# Altium schematic sheet ESP32.SchDoc
size A4
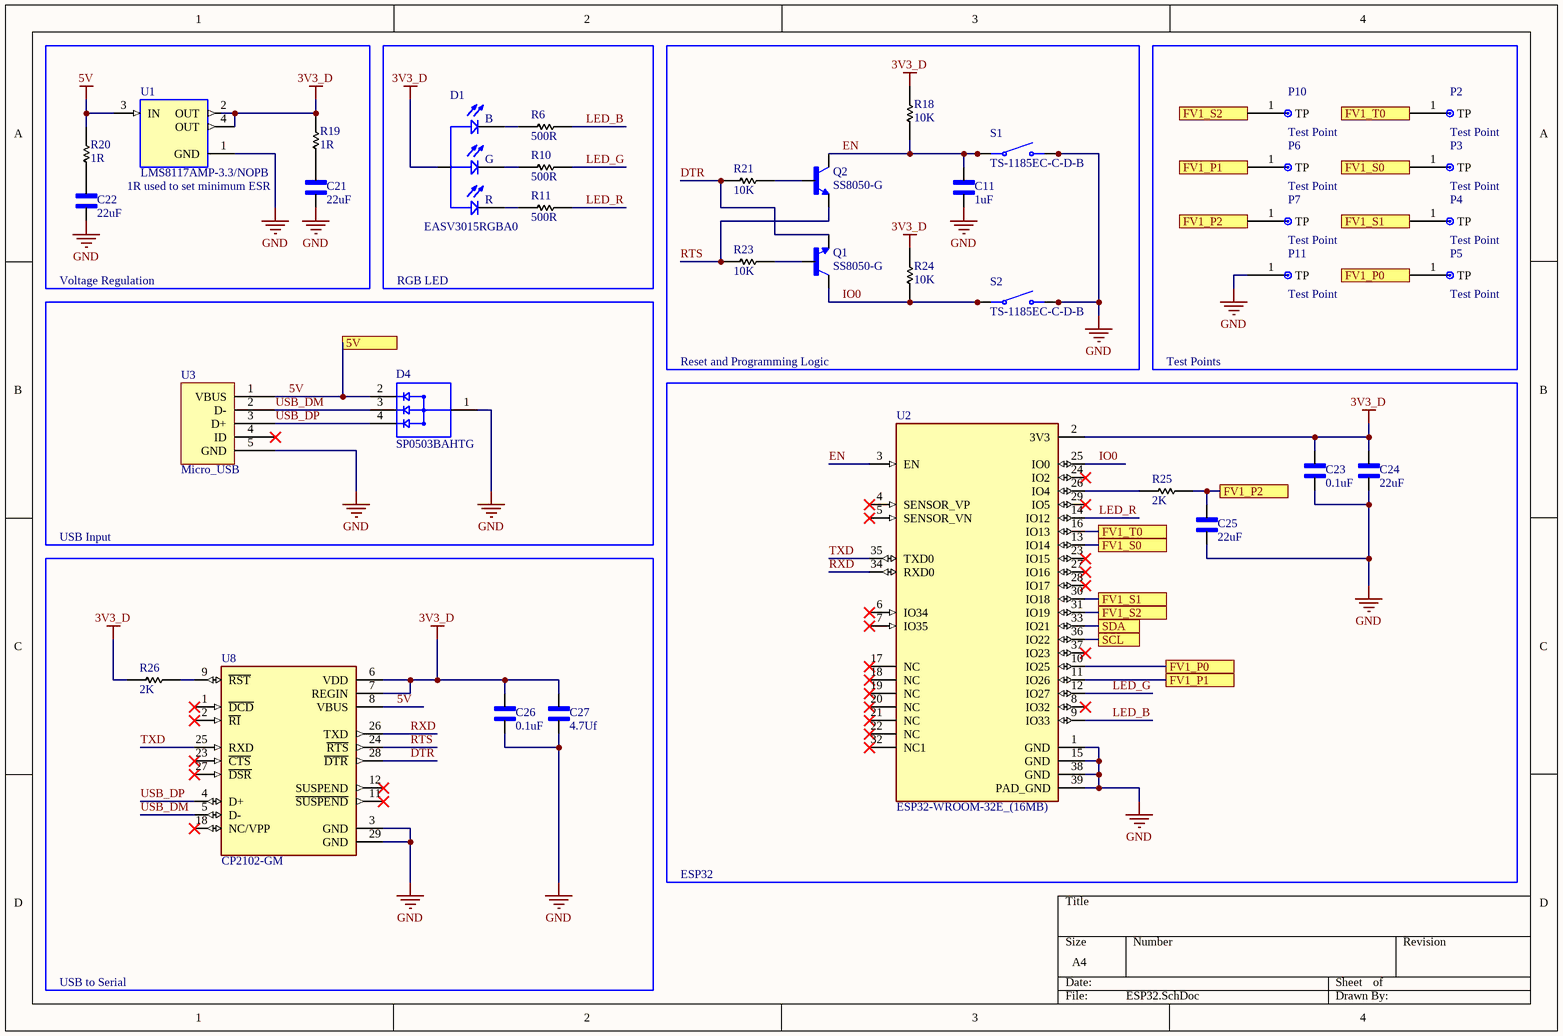
[diagram p0: ESP32.SchDoc]

## Parts
C11  1uF  [CHIP_0603]
C21  22uF  [CHIP_0603]
C22  22uF  [CHIP_0603]
C23  0.1uF  [CHIP_0603]
C24  22uF  [CHIP_0603]
C25  22uF  [CHIP_0603]
C26  0.1uF  [CHIP_0603]
C27  4.7Uf  [CHIP_0603]
D1  EASV3015RGBA0  [LED_EASV3015RGBA0]
D4  SP0503BAHTG  [SP0503BAHTG]
P2  Test Point  [1 Solder Pad]
P3  Test Point  [1 Solder Pad]
P4  Test Point  [1 Solder Pad]
P5  Test Point  [1 Solder Pad]
P6  Test Point  [1 Solder Pad]
P7  Test Point  [1 Solder Pad]
P10  Test Point  [1 Solder Pad]
P11  Test Point  [1 Solder Pad]
Q1  SS8050-G  [SS8050-G]
Q2  SS8050-G  [SS8050-G]
R6  500R  [CHIP_R_0603]
R10  500R  [CHIP_R_0603]
R11  500R  [CHIP_R_0603]
R18  10K  [CHIP_R_0603]
R19  1R  [CHIP_R_0603]
R20  1R  [CHIP_R_0603]
R21  10K  [CHIP_R_0603]
R23  10K  [CHIP_R_0603]
R24  10K  [CHIP_R_0603]
R25  2K  [CHIP_R_0603]
R26  2K  [CHIP_R_0603]
S1  TS-1185EC-C-D-B  [TS-1185EC-C-D-B]
S2  TS-1185EC-C-D-B  [TS-1185EC-C-D-B]
U1  LMS8117AMP-3.3/NOPB  [SOT230P700X180-4N]
U2  ESP32-WROOM-32E_(16MB)  [MODULE_ESP32-WROOM-32E]
U3  Micro_USB  [U254-051T-4BH83-F1S]
U8  CP2102-GM  [QFN50P500X500X100-29N]

## Blocks framed on the sheet
RGB LED: D1 R6 R10 R11
Reset and Programming Logic: C11 Q1 Q2 R18 R21 R23 R24 S1 S2
Test Points: P2-P7 P10 P11
ESP32: C23-C25 R25 U2

## Ports
5V, FV1_P0, FV1_P1, FV1_P2, FV1_S0, FV1_S1, FV1_S2, FV1_T0, SCL, SDA

## Nets
3V3_D: C23.1 C24.1 C26.1 C27.1 D1.1 R18.1 R19.1 R24.1 R26.2 U1.2(OUT) U1.4(OUT) U2.2(3V3) U8.6(VDD) U8.7(REGIN)
5V: D4.2 R20.1 U1.3(IN) U3.1(VBUS) U8.8(VBUS) ; port 5V
GND: C11.2 C21.2 C22.2 C23.2 C24.2 C25.2 C26.2 C27.2 D4.1 P11.1(TP) S1.3(NO) S1.4(NO) S2.3(NO) S2.4(NO) U1.1(GND) U2.1(GND) U2.15(GND) U2.38(GND) U2.39(PAD_GND) U3.5(GND) U8.3(GND) U8.29(GND)
DTR: Q1.2(E) R21.2 U8.28(~{DTR})
EN: C11.1 Q2.3(C) R18.2 S1.1(COM) S1.2(COM) U2.3(EN)
FV1_P0: P5.1(TP) U2.10(IO25) ; port FV1_P0
FV1_P1: P6.1(TP) U2.11(IO26) ; port FV1_P1
FV1_P2: C25.1 P7.1(TP) R25.2 ; port FV1_P2
FV1_S0: P3.1(TP) U2.13(IO14) ; port FV1_S0
FV1_S1: P4.1(TP) U2.30(IO18) ; port FV1_S1
FV1_S2: P10.1(TP) U2.31(IO19) ; port FV1_S2
FV1_T0: P2.1(TP) U2.16(IO13) ; port FV1_T0
IO0: Q1.3(C) R24.2 S2.1(COM) S2.2(COM) U2.25(IO0)
LED_B: R6.1 U2.9(IO33)
LED_G: R10.1 U2.12(IO27)
LED_R: R11.1 U2.14(IO12)
RTS: Q2.2(E) R23.2 U8.24(~{RTS})
RXD: U2.34(RXD0) U8.26(TXD)
SCL: U2.36(IO22) ; port SCL
SDA: U2.33(IO21) ; port SDA
TXD: U2.35(TXD0) U8.25(RXD)
USB_DM: D4.3 U3.2(D-) U8.5(D-)
USB_DP: D4.4 U3.3(D+) U8.4(D+)
NetC21_1: C21.1 R19.2
NetC22_1: C22.1 R20.2
NetD1_2: D1.2 R6.2
NetD1_3: D1.3 R10.2
NetD1_4: D1.4 R11.2
NetQ1_1: Q1.1(B) R23.1
NetQ2_1: Q2.1(B) R21.1
NetR25_1: R25.1 U2.26(IO4)
NetR26_1: R26.1 U8.9(~{RST})

Not connected (* = marked no-connect by the designer): U2 4(SENSOR_VP)* 5(SENSOR_VN)* 6(IO34)* 7(IO35)* 8(IO32)* 17(NC)* 18(NC)* 19(NC)* 20(NC)* 21(NC)* 22(NC)* 23(IO15)* 24(IO2)* 27(IO16)* 28(IO17)* 29(IO5)* 32(NC1)* 37(IO23)*; U3 4(ID)*; U8 1(~{DCD})* 2(~{RI})* 11(~{SUSPEND})* 12(SUSPEND)* 18(NC/VPP)* 23(~{CTS})* 27(~{DSR})*

## Notes on the sheet
- 1R used to set minimum ESR
- Voltage Regulation
- USB Input
- USB to Serial
- (in symbol EASV3015RGBA0) B; G; R

## Library data of the parts
C11 C21-C27 = 0603 Ceramic Capacitor: Generic 0603 Ceramic Capacitor; MP: AC0402FR-071ML; MF: Yageo; Package: 1005 Yageo; SnapEDA_Link: https://www.snapeda.com/parts/AC0402FR-071ML/Yageo/view-part/940461/?ref=snap; Value: *; Mouser-Purchase-URL: https://snapeda.com/shop?store=Mouser&id=940461; DigiKey-Purchase-URL: https://snapeda.com/shop?store=DigiKey&id=940461
D1 = EASV3015RGBA0: Red, Green, Blue _RGB_ 624nm Red, 525nm Green, 470nm Blue LED Indication - Discrete 2V Red, 3.3V Green, 3.3V Blue 4-SMD, No Lead; MF: Everlight Electronics; SnapEDA_Link: https://www.snapeda.com/parts/EASV3015RGBA0/Everlight%20Electronics%20Co%20Ltd/view-part/1921996/?ref=snap; Value: *; Price: None; Availability: Unavailable; MP: EASV3015RGBA0; Package: SMD-4 Everlight Electronics
D4 = SP0503BAHTG: 8.5V Clamp Ipp Tvs Diode Surface Mount SOT-143-4; MF: Littelfuse Inc.; MP: SP0503BAHTG; Package: SOT-143 Littelfuse; SnapEDA_Link: https://www.snapeda.com/parts/SP0503BAHTG/Littelfuse%20Inc./view-part/214427/?ref=snap; Digi-Key_Purchase_URL: https://www.digikey.com/product-detail/en/littelfuse-inc/SP0503BAHTG/F2715CT-ND/1154322?utm_source=snapeda&utm_medium=aggregator&utm_campaign=symbol; Value: *; Digi-Key_Part_Number: F2715CT-ND
P2-P7 P10 P11 = Single Test Point
Q1 Q2 = SS8050-G: NPN TRANSISTOR 1.5A 40V SOT-23 R
R6 R10 R11 R18-R21 R23-R26 = 0603 Generic Resistor: Generic 0603 Resistor
S1 S2 = TS-1185EC-C-D-B: SMD Tactile Switche - 3mm 2mm 50mA 3.65mm SPST 12V
U1 = LMS8117AMP-3.3/NOPB: Fixed 3.3V LDO 1A 15V input SOT-223   Cap ESR between 0.5-5R, 10uF minimum; MF: Texas Instruments; SnapEDA_Link: https://www.snapeda.com/parts/LMS8117AMP-3.3/NOPB/Texas%20Instruments/view-part/104396/?ref=snap; Price: None; Check_prices: https://www.snapeda.com/parts/LMS8117AMP-3.3/NOPB/Texas%20Instruments/view-part/104396/?ref=eda; Purchase-URL: https://pricing.snapeda.com/search/part/LMS8117AMP-3.3/NOPB/?ref=eda; Value: *; MP: LMS8117AMP-3.3/NOPB; Package: SOT-223-4 Texas Instruments; Availability: Warning
U2 = ESP32-WROOM-32E_(16MB): Bluetooth, WiFi 802.11b/g/n, Bluetooth v4.2 +EDR, Class 1, 2 and 3 Transceiver Module 2.4GHz ~ 2.5GHz Integrated, Trace Surface Mount; MP: ESP32-WROOM-32E (16MB); MF: Espressif Systems; Value: *; SnapEDA_Link: https://www.snapeda.com/parts/ESP32-WROOM-32E%20(16MB)/Espressif%20Systems/view-part/4792564/?ref=snap; Check_prices: https://www.snapeda.com/parts/ESP32-WROOM-32E%20(16MB)/Espressif%20Systems/view-part/4792564/?ref=eda; Availability: Unavailable; Price: None; Package: None
U3 = Micro_USB: XKB Connectivity U254-051T-4BH83-F1S
U8 = CP2102-GM: USB Bridge, USB to UART USB 2.0 UART Interface 28-QFN _5x5_; MF: Silicon Labs; Package: QFN-28 Silicon Labs; Value: *; Price: None; MP: CP2102-GM; Availability: Unavailable; SnapEDA_Link: https://www.snapeda.com/parts/CP2102-GM/Silicon%20Labs/view-part/135876/?ref=snap